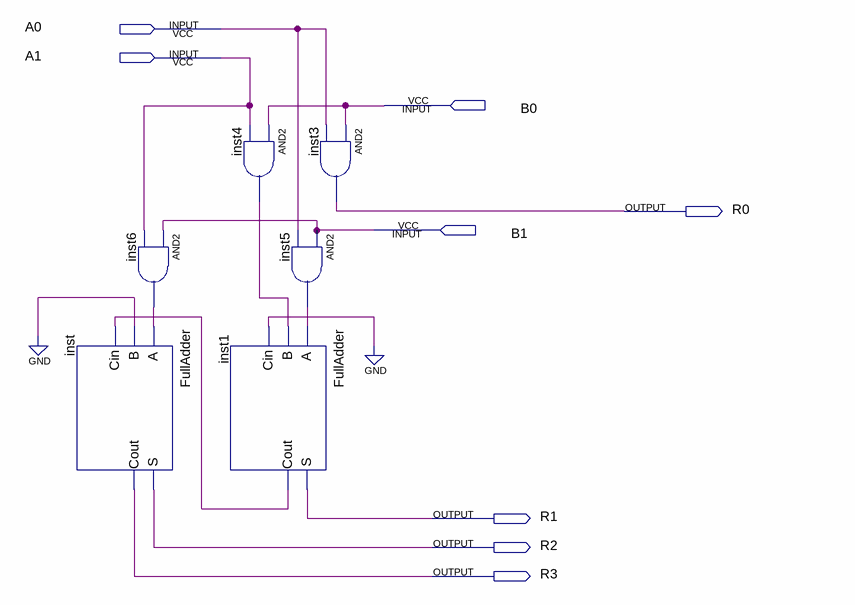
[diagram p0: schematic sheet]
// Quartus schematic MultiplicadorSS.bdf as structural Verilog: 6 symbols, 8 pins
module MultiplicadorSS (
  input  A0,
  input  A1,
  input  B0,
  input  B1,
  output R0,
  output R1,
  output R2,
  output R3
);

  wire inst1_cout, inst4_out, inst5_out, inst6_out;

  FullAdder inst (.A(inst6_out), .B(1'b0), .Cin(inst1_cout), .S(R2), .Cout(R3));
  and inst6 (inst6_out, B1, A1);
  and inst4 (inst4_out, B0, A1);
  FullAdder inst1 (.A(inst5_out), .B(inst4_out), .Cin(1'b0), .S(R1), .Cout(inst1_cout));
  and inst3 (R0, B0, A0);
  and inst5 (inst5_out, B1, A0);
endmodule
